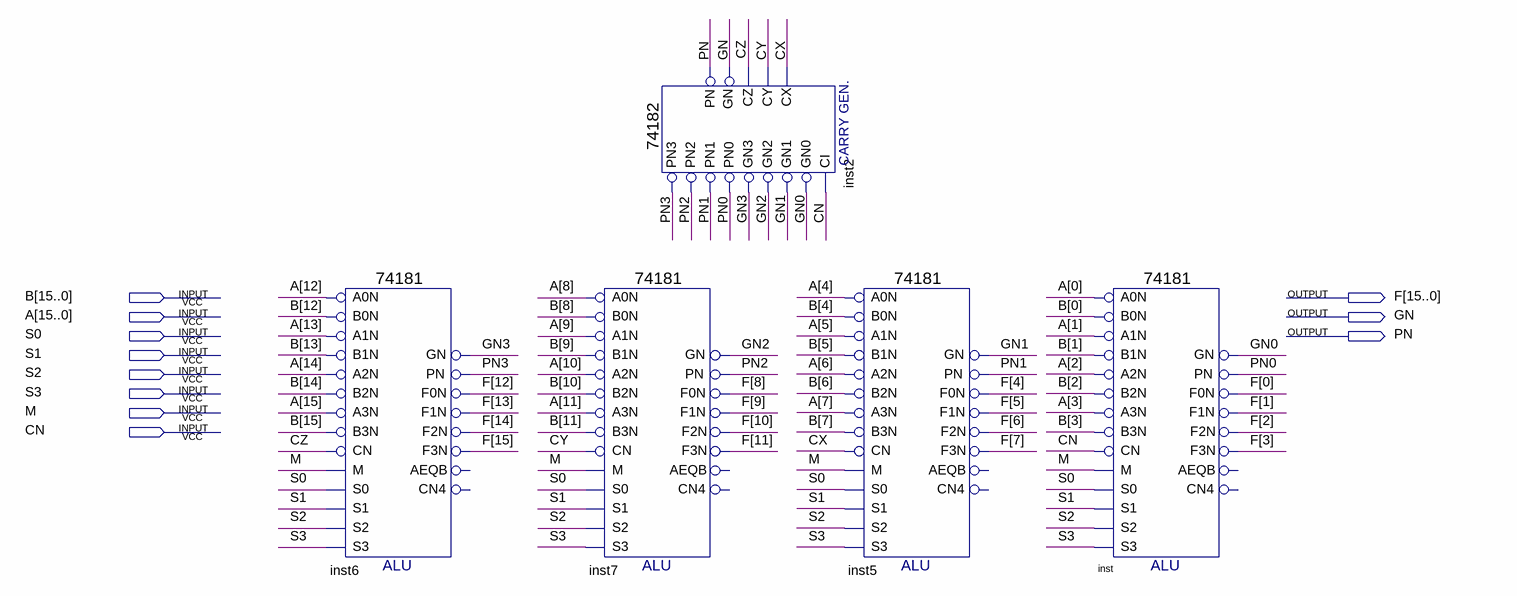
[diagram p0: schematic sheet]
// Quartus schematic ALU_16bit.bdf as structural Verilog: 5 symbols, 11 pins
module ALU_16bit (
  input  [15:0] B,
  input  [15:0] A,
  input  S0,
  input  S1,
  input  S2,
  input  S3,
  input  M,
  input  CN,
  output [15:0] F,
  output GN,
  output PN
);

  wire CX, CY, CZ, GN0, GN1, GN2, GN3, PN0, PN1, PN2, PN3;

  \74181  inst6 (
    .B0N(B[12]), .A0N(A[12]), .A1N(A[13]), .B1N(B[13]), .A3N(A[15]), .B2N(B[14]), .A2N(A[14]), .M(M),
    .CN(CZ), .B3N(B[15]), .S2(S2), .S1(S1), .S0(S0), .S3(S3), .PN(PN3), .GN(GN3), .F3N(F[15]), .F1N(F[13]),
    .F0N(F[12]), .F2N(F[14]));  // open: AEQB, CN4
  \74181  inst7 (
    .B0N(B[8]), .A0N(A[8]), .A1N(A[9]), .B1N(B[9]), .A3N(A[11]), .B2N(B[10]), .A2N(A[10]), .M(M), .CN(CY),
    .B3N(B[11]), .S2(S2), .S1(S1), .S0(S0), .S3(S3), .PN(PN2), .GN(GN2), .F3N(F[11]), .F1N(F[9]), .F0N(F[8]),
    .F2N(F[10]));  // open: AEQB, CN4
  \74182  inst2 (
    .PN2(PN2), .GN2(GN2), .GN3(GN3), .PN3(PN3), .CI(CN), .PN1(PN1), .PN0(PN0), .GN1(GN1), .GN0(GN0), .CY(CY),
    .PN(PN), .CX(CX), .CZ(CZ), .GN(GN));
  \74181  inst5 (
    .B0N(B[4]), .A0N(A[4]), .A1N(A[5]), .B1N(B[5]), .A3N(A[7]), .B2N(B[6]), .A2N(A[6]), .M(M), .CN(CX),
    .B3N(B[7]), .S2(S2), .S1(S1), .S0(S0), .S3(S3), .PN(PN1), .GN(GN1), .F3N(F[7]), .F1N(F[5]), .F0N(F[4]),
    .F2N(F[6]));  // open: AEQB, CN4
  \74181  inst (
    .B0N(B[0]), .A0N(A[0]), .A1N(A[1]), .B1N(B[1]), .A3N(A[3]), .B2N(B[2]), .A2N(A[2]), .M(M), .CN(CN),
    .B3N(B[3]), .S2(S2), .S1(S1), .S0(S0), .S3(S3), .PN(PN0), .GN(GN0), .F3N(F[3]), .F1N(F[1]), .F0N(F[0]),
    .F2N(F[2]));  // open: AEQB, CN4
endmodule
